# EAGLE design ardweeny-shield-adapter (EAGLE 5.10)
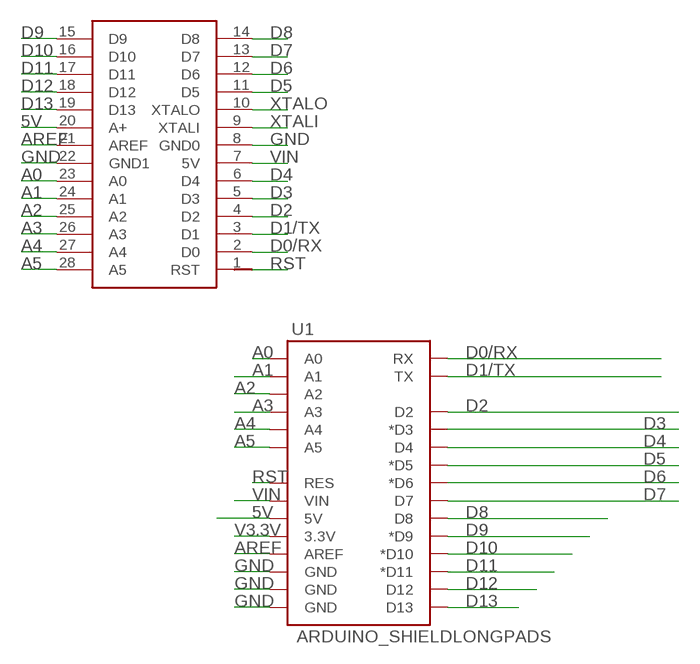
[diagram p0: schematic, sheet 1]

## Parts
U1  ARDUINO_SHIELDLONGPADS  [DUEMILANOVE_SHIELD_LONGPADS]
U$2  ARDWEENY  [DIL28-3]

## Nets
5V: U1.5V U$2.20(A+)
A0: U1.A0 U$2.23(A0)
A1: U1.A1 U$2.24(A1)
A2: U1.A2 U$2.25(A2)
A3: U1.A3 U$2.26(A3)
A4: U1.A4 U$2.27(A4)
A5: U1.A5 U$2.28(A5)
AREF: U1.AREF U$2.21(AREF)
D0/RX: U1.RX U$2.2(D0)
D1/TX: U1.TX U$2.3(D1)
D2: U1.D2 U$2.4(D2)
D3: U1.D3(*D3) U$2.5(D3)
D4: U1.D4 U$2.6(D4)
D5: U1.D5(*D5) U$2.11(D5)
D6: U1.D6(*D6) U$2.12(D6)
D7: U1.D7 U$2.13(D7)
D8: U1.D8 U$2.14(D8)
D9: U1.D9(*D9) U$2.15(D9)
D10: U1.D10(*D10) U$2.16(D10)
D11: U1.D11(*D11) U$2.17(D11)
D12: U1.D12 U$2.18(D12)
D13: U1.D13 U$2.19(D13)
GND: U1.GND@0(GND) U1.GND@1(GND) U1.GND@2(GND) U$2.8(GND0) U$2.22(GND1)
RST: U1.RES U$2.1(RST)
V3.3V: U1.3.3V
VIN: U1.VIN U$2.7(5V)
XTALI: U$2.9(XTALI)
XTALO: U$2.10(XTALO)

## Library data of the parts
U1 = SparkFun:ARDUINO_SHIELD
U$2 = ideabot:ARDWEENY

## Board
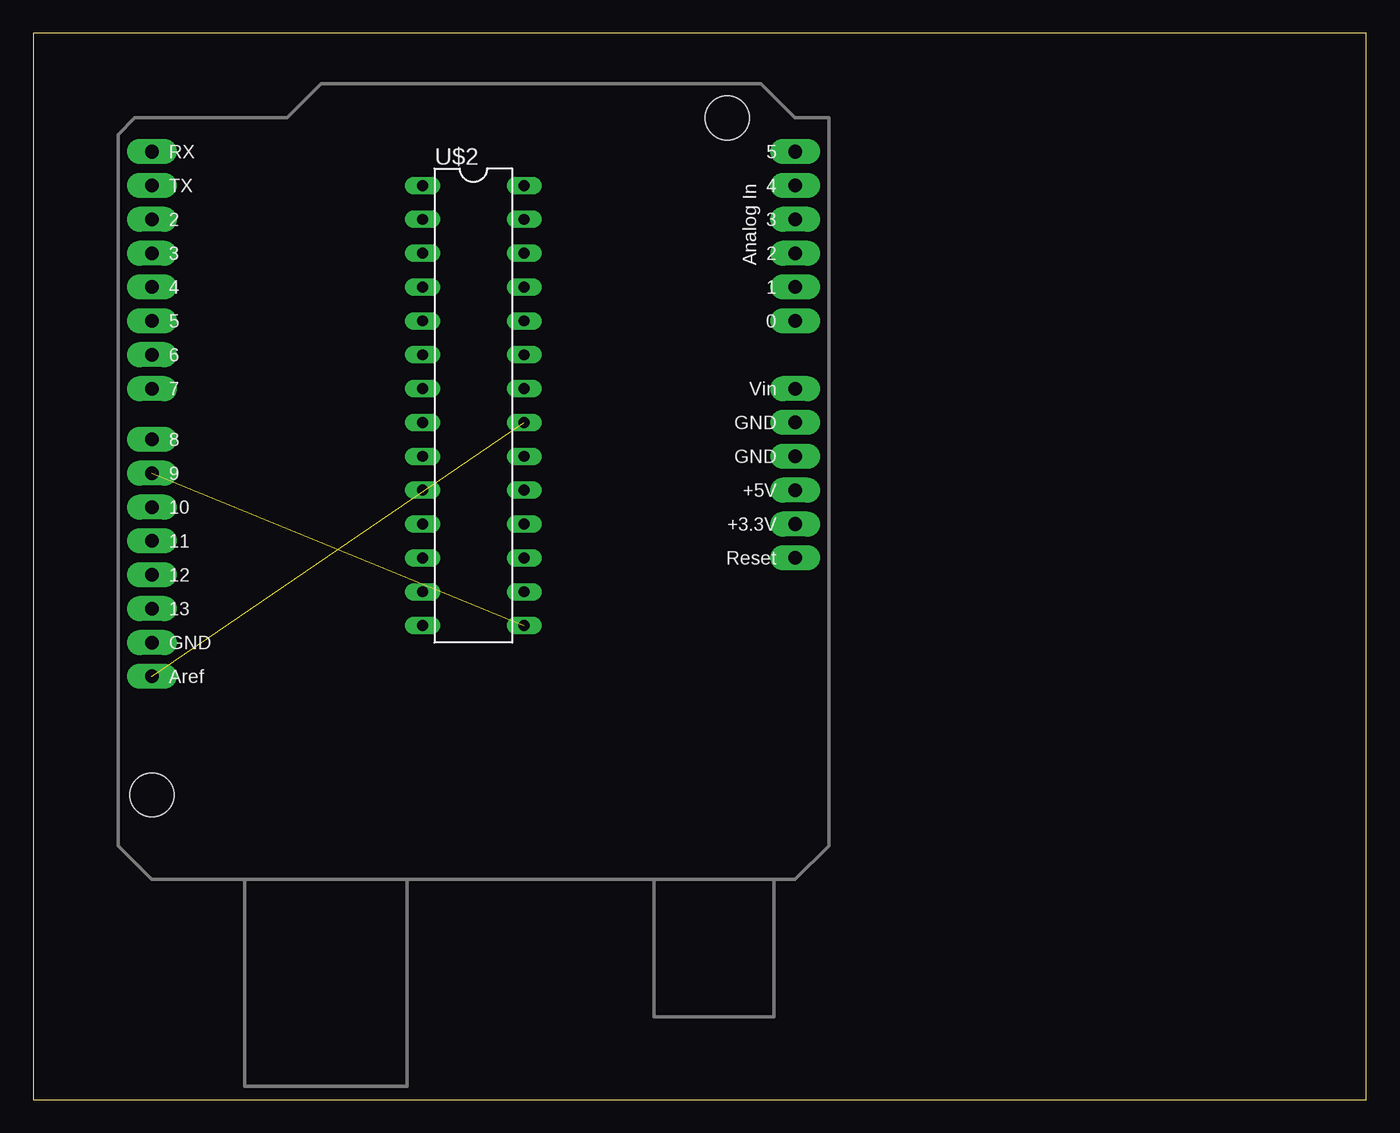
[diagram p1: board, top side]
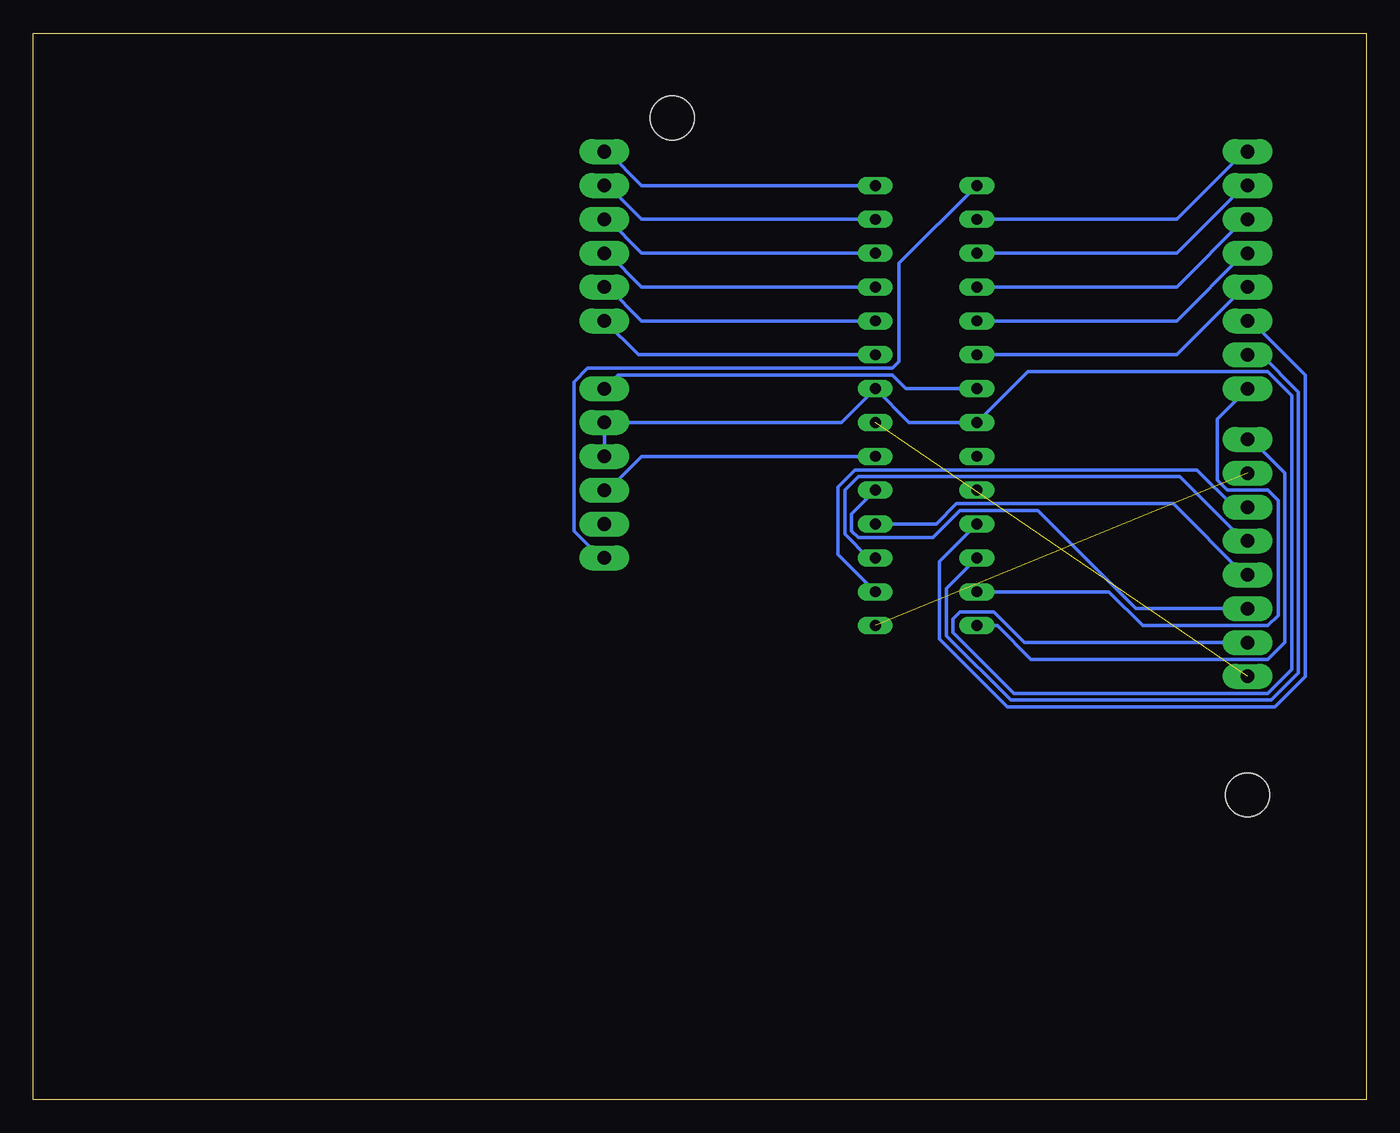
[diagram p2: board, bottom side, seen from below]

Size 100 x 80 mm. Coordinates in mm from the lower left corner, seen from the top.
Outline: 0,0 100,0 100,80 0,80 0,0
Copper layers (1*16): Top 0.035mm / dielectric 1.5mm / Bottom 0.035mm
Design rules "default": minimum track width 10mil, minimum drill 24mil, track to track 8mil, track to pad 8mil, pad to pad 8mil, via to via 8mil, smd to smd 8mil, copper to edge 40mil, drill to drill 8mil, minimum pad ring 10mil, minimum via ring 8mil, stop-mask expansion 4mil, vias tented up to drill 0mil, thermal gap 10mil

### Footprints (pad centres in the part's own frame; a part is rotated, then mirrored left to right if it is on the bottom)
DUEMILANOVE_SHIELD_LONGPADS = drill 1.016 pad 1.88 long: 3.3V 50.8,26.67; 5V 50.8,29.21; A0 50.8,41.91; A1 50.8,44.45; A2 50.8,46.99; A3 50.8,49.53; A4 50.8,52.07; A5 50.8,54.61; AREF 2.54,15.24; D2 2.54,49.53; D3 2.54,46.99; D4 2.54,44.45; D5 2.54,41.91; D6 2.54,39.37; D7 2.54,36.83; D8 2.54,33.02; D9 2.54,30.48; D10 2.54,27.94; D11 2.54,25.4; D12 2.54,22.86; D13 2.54,20.32; GND@0 50.8,31.75; GND@1 50.8,34.29; GND@2 2.54,17.78; RES 50.8,24.13; RX 2.54,54.61; TX 2.54,52.07; VIN 50.8,36.83 | hole 3.302: 45.72,57.15; 2.54,6.35
DIL28-3 = drill 0.813 long: 1 -16.51,-3.81; 2 -13.97,-3.81; 3 -11.43,-3.81; 4 -8.89,-3.81; 5 -6.35,-3.81; 6 -3.81,-3.81; 7 -1.27,-3.81; 8 1.27,-3.81; 9 3.81,-3.81; 10 6.35,-3.81; 11 8.89,-3.81; 12 11.43,-3.81; 13 13.97,-3.81; 14 16.51,-3.81; 15 16.51,3.81; 16 13.97,3.81; 17 11.43,3.81; 18 8.89,3.81; 19 6.35,3.81; 20 3.81,3.81; 21 1.27,3.81; 22 -1.27,3.81; 23 -3.81,3.81; 24 -6.35,3.81; 25 -8.89,3.81; 26 -11.43,3.81; 27 -13.97,3.81; 28 -16.51,3.81

### Placement (x,y rotation side)
U1  6.35,16.51 0 top
U$2  33.02,52.07 270 top

### Tracks (layer width: path | path; a pad name or v marks a point on that pad's centre or on a via)
5V
  Bottom 0.254: U$2.20 54.36,48.26 56.9,45.72 U1.5V
A0
  Bottom 0.254: U$2.23 54.61,55.88 U1.A0
A1
  Bottom 0.254: U$2.24 54.36,58.42 56.9,60.96 U1.A1
A2
  Bottom 0.254: U$2.25 54.36,60.96 56.9,63.5 U1.A2
A3
  Bottom 0.254: U$2.26 54.36,63.5 56.9,66.04 U1.A3
A4
  Bottom 0.254: U$2.27 54.36,66.04 56.9,68.58 U1.A4
A5
  Bottom 0.254: U$2.28 54.36,68.58 56.9,71.12 U1.A5
AREF  (1 unrouted)
D0/RX
  Bottom 0.254: U$2.2 14.22,66.04 9.14,71.12 U1.RX
D1/TX
  Bottom 0.254: U$2.3 14.22,63.5 9.14,68.58 U1.TX
D2
  Bottom 0.254: U$2.4 14.22,60.96 9.14,66.04 U1.D2
D3
  Bottom 0.254: U$2.5 14.22,58.42 9.14,63.5 U1.D3
D4
  Bottom 0.254: U$2.6 14.22,55.88 9.14,60.96 U1.D4
D5
  Bottom 0.254: U$2.11 32,40.39 32,34.54 26.92,29.46 6.86,29.46 4.57,31.75 4.57,54.36 8.64,58.42 U1.D5
D6
  Bottom 0.254: U$2.12 31.5,38.35 31.5,34.8 26.67,29.97 7.11,29.97 5.08,32 5.08,53.09 7.87,55.88 U1.D6
D7
  Bottom 0.254: U$2.13 19.3,38.1 16.76,35.56 7.37,35.56 6.6,36.32 6.6,44.96 7.37,45.72 10.41,45.72 11.18,46.48 11.18,51.05 U1.D7
D8
  Bottom 0.254: U$2.14 27.69,35.56 25.15,33.02 7.37,33.02 6.1,34.29 6.1,46.99 8.64,49.53 U1.D8
D9  (1 unrouted)
D10
  Bottom 0.254: U$2.16 39.62,40.89 39.62,45.97 38.35,47.24 12.7,47.24 9.91,44.45 U1.D10
D11
  Bottom 0.254: U$2.17 37.34,40.64 39.12,42.42 39.12,45.72 38.1,46.74 13.97,46.74 9.14,41.91 U1.D11
D12
  Bottom 0.254: U$2.18 32.26,43.18 30.73,44.7 14.48,44.7 9.14,39.37 U1.D12
D13
  Bottom 0.254: U$2.19 38.61,43.94 38.61,42.67 38.1,42.16 32.51,42.16 30.48,44.2 24.64,44.2 17.27,36.83 U1.D13
GND
  Bottom 0.254: U1.GND@0 U1.GND@1 39.37,50.8 U$2.22 34.29,50.8 U$2.8 25.4,54.61 7.37,54.61 5.59,52.83 5.59,32.26 7.37,30.48 26.42,30.48 30.99,35.05 30.99,36.07 30.48,36.58 27.94,36.58 25.65,34.29 U1.GND@2
RST
  Bottom 0.254: U$2.1 35.05,62.74 35.05,55.37 35.56,54.86 58.42,54.86 59.44,53.85 59.44,42.67 57.4,40.64 U1.RES
VIN
  Bottom 0.254: U$2.7 34.54,53.34 35.56,54.36 56.13,54.36 U1.VIN